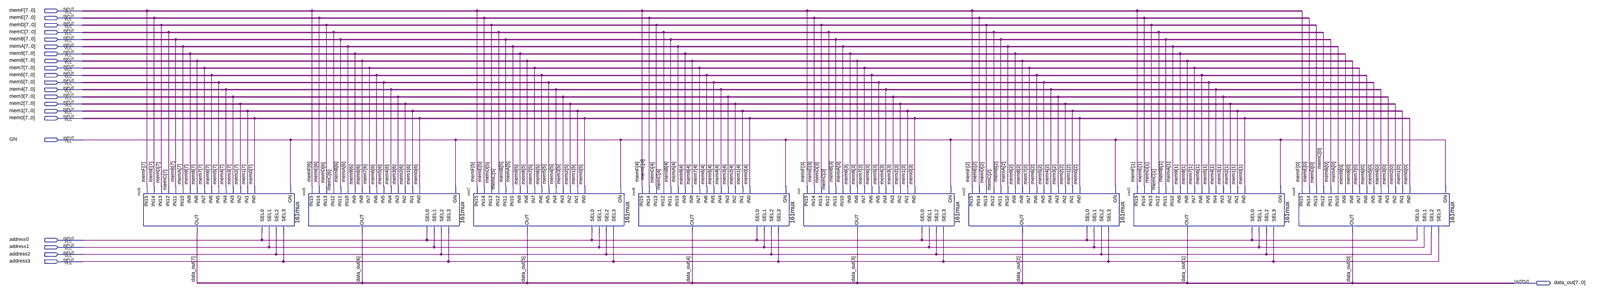
[diagram p0: schematic sheet, whole]
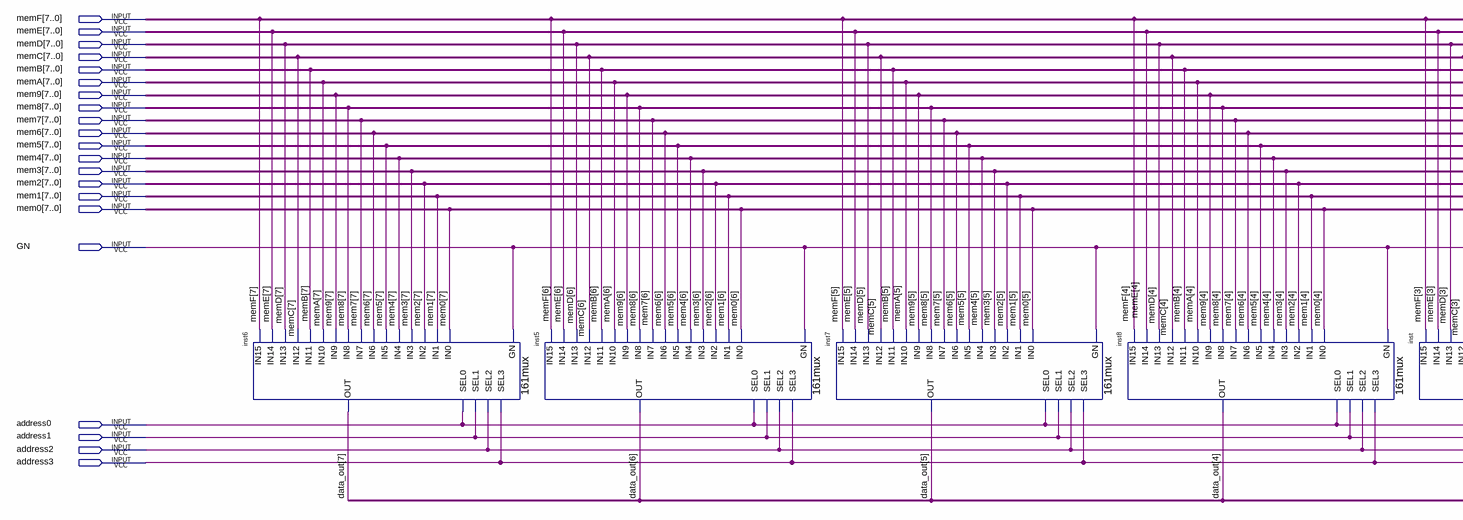
[diagram p1: schematic sheet, left part]
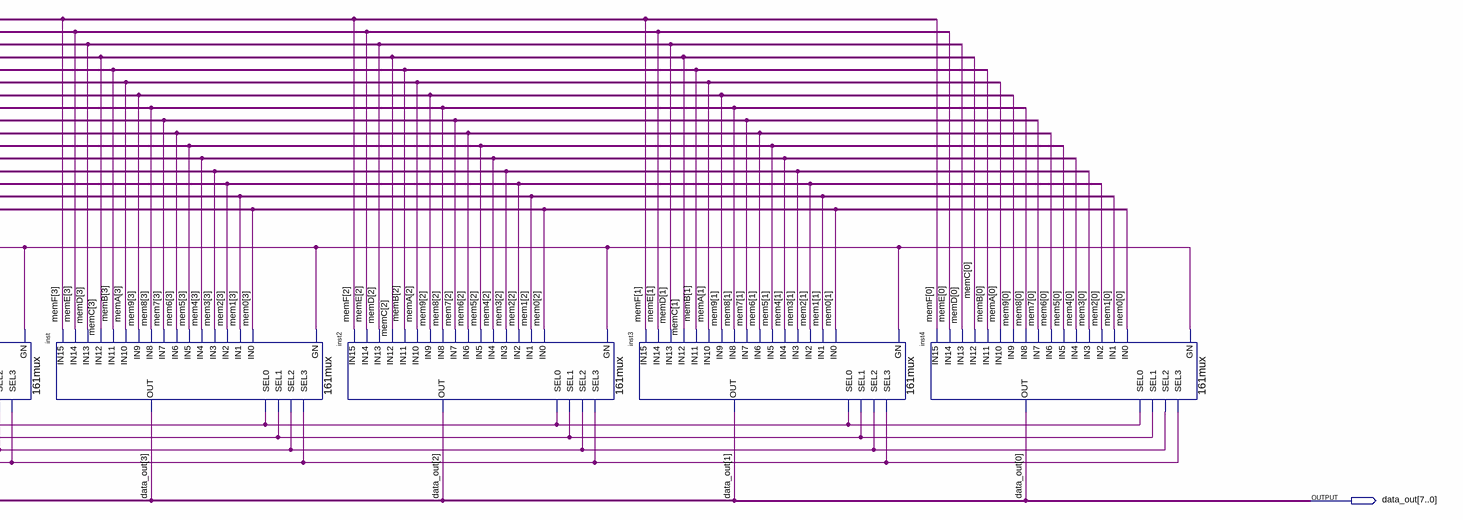
[diagram p2: schematic sheet, right part]
// Quartus schematic mux16busx1.bdf as structural Verilog: 8 symbols, 22 pins
module mux16busx1 (
  input  [7:0] memF,
  input  [7:0] memE,
  input  [7:0] memD,
  input  [7:0] memC,
  input  [7:0] memB,
  input  [7:0] memA,
  input  [7:0] mem9,
  input  [7:0] mem8,
  input  [7:0] mem7,
  input  [7:0] mem6,
  input  [7:0] mem5,
  input  [7:0] mem4,
  input  [7:0] mem3,
  input  [7:0] mem2,
  input  [7:0] mem1,
  input  [7:0] mem0,
  input  GN,
  input  address0,
  input  address1,
  input  address2,
  input  address3,
  output [7:0] data_out
);

  \161mux  inst6 (
    .SEL3(address3), .GN(GN), .IN0(mem0[7]), .SEL0(address0), .SEL1(address1), .SEL2(address2),
    .IN3(mem3[7]), .IN2(mem2[7]), .IN1(mem1[7]), .IN6(mem6[7]), .IN5(mem5[7]), .IN4(mem4[7]), .IN9(mem9[7]),
    .IN8(mem8[7]), .IN7(mem7[7]), .IN11(memB[7]), .IN12(memC[7]), .IN10(memA[7]), .IN15(memF[7]),
    .IN14(memE[7]), .IN13(memD[7]), .OUT(data_out[7]));
  \161mux  inst5 (
    .SEL3(address3), .GN(GN), .IN0(mem0[6]), .SEL0(address0), .SEL1(address1), .SEL2(address2),
    .IN3(mem3[6]), .IN2(mem2[6]), .IN1(mem1[6]), .IN6(mem6[6]), .IN5(mem5[6]), .IN4(mem4[6]), .IN9(mem9[6]),
    .IN8(mem8[6]), .IN7(mem7[6]), .IN11(memB[6]), .IN12(memC[6]), .IN10(memA[6]), .IN15(memF[6]),
    .IN14(memE[6]), .IN13(memD[6]), .OUT(data_out[6]));
  \161mux  inst7 (
    .SEL3(address3), .GN(GN), .IN0(mem0[5]), .SEL0(address0), .SEL1(address1), .SEL2(address2),
    .IN3(mem3[5]), .IN2(mem2[5]), .IN1(mem1[5]), .IN6(mem6[5]), .IN5(mem5[5]), .IN4(mem4[5]), .IN9(mem9[5]),
    .IN8(mem8[5]), .IN7(mem7[5]), .IN11(memB[5]), .IN12(memC[5]), .IN10(memA[5]), .IN15(memF[5]),
    .IN14(memE[5]), .IN13(memD[5]), .OUT(data_out[5]));
  \161mux  inst8 (
    .SEL3(address3), .GN(GN), .IN0(mem0[4]), .SEL0(address0), .SEL1(address1), .SEL2(address2),
    .IN3(mem3[4]), .IN2(mem2[4]), .IN1(mem1[4]), .IN6(mem6[4]), .IN5(mem5[4]), .IN4(mem4[4]), .IN9(mem9[4]),
    .IN8(mem8[4]), .IN7(mem7[4]), .IN11(memB[4]), .IN12(memC[4]), .IN10(memA[4]), .IN15(memF[4]),
    .IN14(memE[4]), .IN13(memD[4]), .OUT(data_out[4]));
  \161mux  inst (
    .SEL3(address3), .GN(GN), .IN0(mem0[3]), .SEL0(address0), .SEL1(address1), .SEL2(address2),
    .IN3(mem3[3]), .IN2(mem2[3]), .IN1(mem1[3]), .IN6(mem6[3]), .IN5(mem5[3]), .IN4(mem4[3]), .IN9(mem9[3]),
    .IN8(mem8[3]), .IN7(mem7[3]), .IN11(memB[3]), .IN12(memC[3]), .IN10(memA[3]), .IN15(memF[3]),
    .IN14(memE[3]), .IN13(memD[3]), .OUT(data_out[3]));
  \161mux  inst2 (
    .SEL3(address3), .GN(GN), .IN0(mem0[2]), .SEL0(address0), .SEL1(address1), .SEL2(address2),
    .IN3(mem3[2]), .IN2(mem2[2]), .IN1(mem1[2]), .IN6(mem6[2]), .IN5(mem5[2]), .IN4(mem4[2]), .IN9(mem9[2]),
    .IN8(mem8[2]), .IN7(mem7[2]), .IN11(memB[2]), .IN12(memC[2]), .IN10(memA[2]), .IN15(memF[2]),
    .IN14(memE[2]), .IN13(memD[2]), .OUT(data_out[2]));
  \161mux  inst3 (
    .SEL3(address3), .GN(GN), .IN0(mem0[1]), .SEL0(address0), .SEL1(address1), .SEL2(address2),
    .IN3(mem3[1]), .IN2(mem2[1]), .IN1(mem1[1]), .IN6(mem6[1]), .IN5(mem5[1]), .IN4(mem4[1]), .IN9(mem9[1]),
    .IN8(mem8[1]), .IN7(mem7[1]), .IN11(memB[1]), .IN12(memC[1]), .IN10(memA[1]), .IN15(memF[1]),
    .IN14(memE[1]), .IN13(memD[1]), .OUT(data_out[1]));
  \161mux  inst4 (
    .SEL3(address3), .GN(GN), .IN0(mem0[0]), .SEL0(address0), .SEL1(address1), .SEL2(address2),
    .IN3(mem3[0]), .IN2(mem2[0]), .IN1(mem1[0]), .IN6(mem6[0]), .IN5(mem5[0]), .IN4(mem4[0]), .IN9(mem9[0]),
    .IN8(mem8[0]), .IN7(mem7[0]), .IN11(memB[0]), .IN12(memC[0]), .IN10(memA[0]), .IN15(memF[0]),
    .IN14(memE[0]), .IN13(memD[0]), .OUT(data_out[0]));
endmodule
